# Altium schematic sheet Architecture.SchDoc
size A4; SheetNumber: 1; SheetTotal: 2
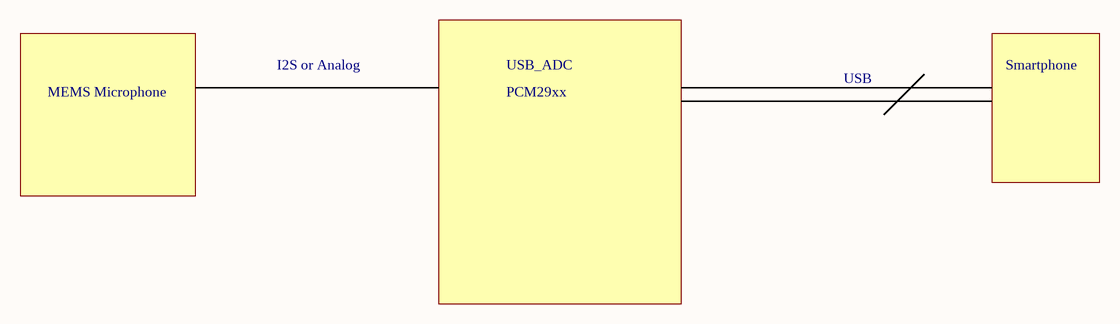
[diagram p0: Architecture.SchDoc]

## Notes on the sheet
- MEMS Microphone
- I2S or Analog
- USB_ADC
- PCM29xx
- USB
- Smartphone